# EAGLE design RFID_H2_v3 (EAGLE 9.6.1)
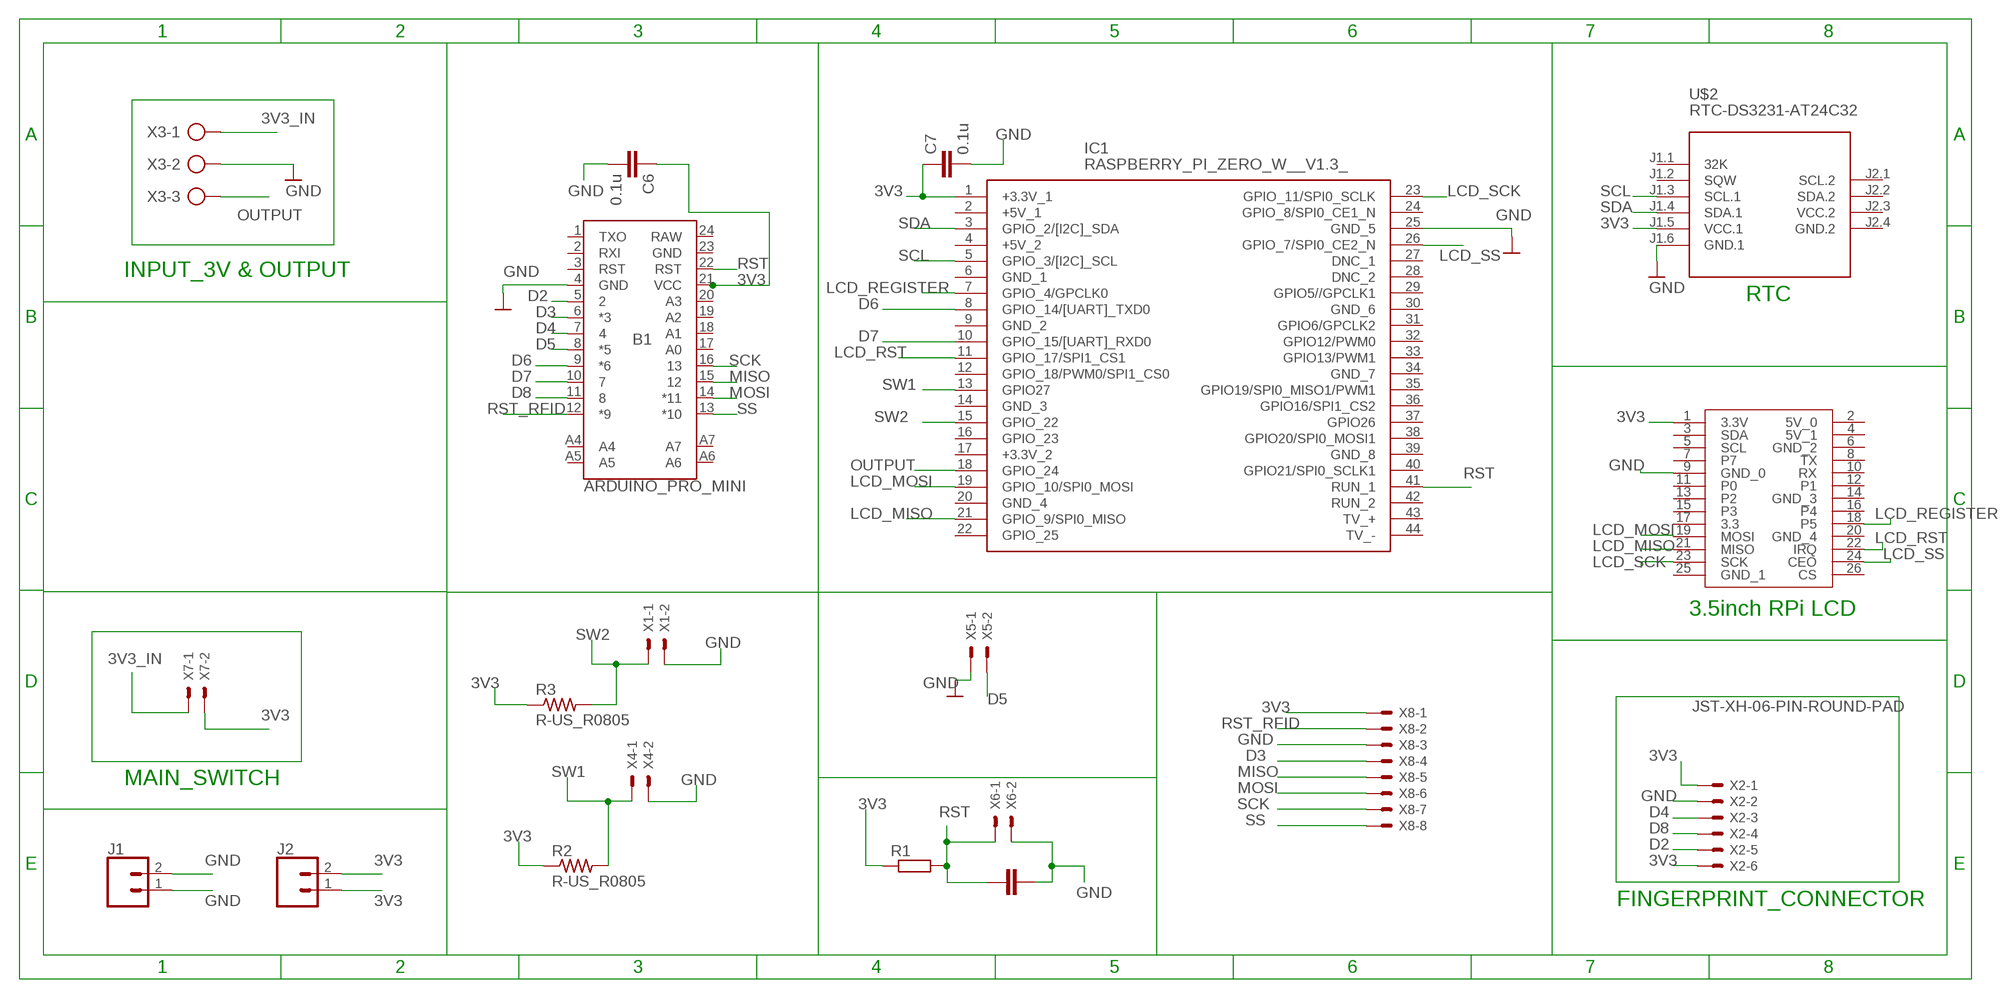
[diagram p0: schematic, sheet 1]

## Parts
B1  ARDUINO_PRO_MINI  [ARDUINO_PRO_MINI]
C5  10n  C-EUC0805K  [C0805K]
C6  0.1u  C-EUC0805  [C0805]
C7  0.1u  C-EUC0805  [C0805]
IC1  RASPBERRY_PI_ZERO_W__V1.3_  [RASPBERRYPIZEROWV13]
J1  CONN_02  [1X02]
J2  CONN_02  [1X02]
R1  R-EU_0204/5  [0204/5]
R2  R-US_R0805  [R0805]
R3  R-US_R0805  [R0805]
U$2  RTC-DS3231-AT24C32  [RTC-DS3231-AT24C32]
U$7  3.5_INCH_TOUCHSCREEN  [FE13-2]
X1  JST-XH-02-PIN-LONG-PAD  [JST-XH-02-PACKAGE-LONG-PAD]
X2  JST-XH-06-PIN-ROUND-PAD  [JST-XH-06-PACKAGE-ROUND-PAD]
X3  AK500/3-H  [AK500/3-H]
X4  JST-XH-02-PIN-LONG-PAD  [JST-XH-02-PACKAGE-LONG-PAD]
X5  JST-XH-02-PIN-LONG-PAD  [JST-XH-02-PACKAGE-LONG-PAD]
X6  JST-XH-02-PIN-LONG-PAD  [JST-XH-02-PACKAGE-LONG-PAD]
X7  JST-XH-02-PIN-LONG-PAD  [JST-XH-02-PACKAGE-LONG-PAD]
X8  JST-XH-08-PIN-ROUND-PAD  [JST-XH-08-PACKAGE-ROUND-PAD]

## Nets
3V3: B1.21(VCC) C6.1 C7.1 IC1.1(+3.3V_1) J2.1 J2.2 R1.1 R2.1 R3.1 U$2.J1.5(VCC.1) U$7.1(3.3V) X2.1 X2.6 X7.2 X8.1
3V3_IN: X3.1 X7.1
D2: B1.5 X2.5
D3: B1.6(*3) X8.4
D4: B1.7 X2.3
D5: B1.8(*5) X5.2
D6: B1.9(*6) IC1.8(GPIO_14/[UART]_TXD0)
D7: B1.10 IC1.10(GPIO_15/[UART]_RXD0)
D8: B1.11 X2.4
GND: B1.4(GND) C5.1 C6.2 C7.2 IC1.25(GND_5) J1.1 J1.2 U$2.J1.6(GND.1) U$7.9(GND_0) X1.2 X2.2 X3.2 X4.2 X5.1 X6.2 X8.3
LCD_MISO: IC1.21(GPIO_9/SPI0_MISO) U$7.21(MISO)
LCD_MOSI: IC1.19(GPIO_10/SPI0_MOSI) U$7.19(MOSI)
LCD_REGISTER: IC1.7(GPIO_4/GPCLK0) U$7.18(P5)
LCD_RST: IC1.11(GPIO_17/SPI1_CS1) U$7.22(IRQ)
LCD_SCK: IC1.23(GPIO_11/SPI0_SCLK) U$7.23(SCK)
LCD_SS: IC1.26(GPIO_7/SPI0_CE2_N) U$7.24(CEO)
MISO: B1.15 X8.5
MOSI: B1.14(*11) X8.6
OUTPUT: IC1.18(GPIO_24) X3.3
RST: B1.22(RST) C5.2 IC1.41(RUN_1) R1.2 X6.1
RST_RFID: B1.12(*9) X8.2
SCK: B1.16 X8.7
SCL: IC1.5(GPIO_3/[I2C]_SCL) U$2.J1.3(SCL.1)
SDA: IC1.3(GPIO_2/[I2C]_SDA) U$2.J1.4(SDA.1)
SS: B1.13(*10) X8.8
SW1: IC1.13(GPIO27) R2.2 X4.1
SW2: IC1.15(GPIO_22) R3.2 X1.1
Unconnected: B1.1(TXO) B1.2(RXI) B1.3(RST) B1.17(A0) B1.18(A1) B1.19(A2) B1.20(A3) B1.A4 B1.A5 B1.A6 B1.A7 IC1.2(+5V_1) IC1.4(+5V_2) IC1.6(GND_1) IC1.9(GND_2) IC1.12(GPIO_18/PWM0/SPI1_CS0) IC1.14(GND_3) IC1.16(GPIO_23) IC1.17(+3.3V_2) IC1.20(GND_4) IC1.22(GPIO_25) IC1.24(GPIO_8/SPI0_CE1_N) IC1.27(DNC_1) IC1.28(DNC_2) IC1.29(GPIO5//GPCLK1) IC1.30(GND_6) IC1.31(GPIO6/GPCLK2) IC1.32(GPIO12/PWM0) IC1.33(GPIO13/PWM1) IC1.34(GND_7) IC1.35(GPIO19/SPI0_MISO1/PWM1) IC1.36(GPIO16/SPI1_CS2) IC1.37(GPIO26) IC1.38(GPIO20/SPI0_MOSI1) IC1.39(GND_8) IC1.40(GPIO21/SPI0_SCLK1) IC1.42(RUN_2) IC1.43(TV_+) IC1.44(TV_-) U$2.J1.1(32K) U$2.J1.2(SQW) U$2.J2.1(SCL.2) U$2.J2.2(SDA.2) U$7.2(5V_0) U$7.3(SDA) U$7.4(5V_1) U$7.5(SCL) U$7.6(GND_2) U$7.7 U$7.8(TX) U$7.10(RX) U$7.11(P0) U$7.12(P1) U$7.13(P2) U$7.14(GND_3) U$7.15(P3) U$7.16(P4) U$7.17(3.3) U$7.20(GND_4) U$7.25(GND_1) U$7.26(CS)

## Notes on the sheet
- INPUT_3V & OUTPUT
- RTC
- 3.5inch RPi LCD
- MAIN_SWITCH
- FINGERPRINT_CONNECTOR

## Power pins joined to a net without a drawn wire
GND: B1.23(GND)
GND.2: U$2.J2.4(GND.2)
RAW: B1.24(RAW)
VCC.2: U$2.J2.3(VCC.2)

## Library data of the parts
B1 = SparkFun-Boards:ARDUINO_PRO_MINI: SparkFun Pro Mini Pro Mini compatible footprint. Dimensions: 0.7 x 1.3" PCB Thickness: 0.8mm SparkFun Products: 3.3V/8MHz <https://www.sparkfun.com/products/11114> 5V/16MHz <https://www.sparkfun.com/products/11113>
C5-C7 = rcl:C-EU: CAPACITOR, European symbol; SPICEPREFIX: C
IC1 = Raspberry_Pi_Zero_W__v1.3_:RASPBERRY_PI_ZERO_W__V1.3_: Raspberry Pi Zero W (v1.3) Single-board Computers Source: Datasheet <https://cdn.sparkfun.com/assets/learn_tutorials/6/7/6/PiZero_1.pdf>; DESCRIPTION: Raspberry Pi Zero W (v1.3) Single-board Computers; HEIGHT: mm; MANUFACTURER_NAME: RASPBERRY-PI; MANUFACTURER_PART_NUMBER: Raspberry Pi Zero W (v1.3)
J1 J2 = SparkFun-Connectors:CONN_02: Multi connection point. Often used as Generic Header-pin footprint for 0.1 inch spaced/style header connections On any of the 0.1 inch spaced packages, you can populate with these: Break Away Headers - Straight <https://www.sparkfun.com/products/116> (PRT-00116) Break Away Male Headers - Right Angle <https://www.sparkfun.com/products/553> (PRT-00553) Female Headers <https://www.sparkfun.com/products/115> (PRT-00115) Break Away Headers - Machine Pin <https://www.sparkfun.com/products/117> (PRT-00117) Break Away Female Headers - Swiss Machine Pin <https://www.sparkfun.com/products/743> (PRT-00743) For SCREWTERMINALS and SPRING TERMINALS visit here: Screw Terimnals on SparkFun.com <https://www.sparkfun.com/search/results?term=Screw+Terminals> (5mm/3.5mm/2.54mm spacing) This device is also useful as a general connection point to wire up your design to another part of your project. Our various solder wires solder well into these plated through hole pads. Hook-Up Wire - Assortment (Stranded, 22 AWG) <https://www.sparkfun.com/products/11375> (PRT-11375) Hook-Up Wire - Assortment (Solid Core, 22 AWG) <https://www.sparkfun.com/products/11367> (PRT-11367) View the entire wire category on our website here <https://www.sparkfun.com/categories/141> Special notes: Molex polarized connector foot print use with: PRT-08233 with associated crimp pins and housings. 2.54_SCREWTERM for use with PRT-10571. 3.5mm Screw Terminal footprints for PRT-08084 5mm Screw Terminal footprints for use with PRT-08432
R1 = resistor:R-EU_: RESISTOR, European symbol
R2 R3 = audio amplifier example:R-US_: RESISTOR, American symbol
U$2 = diy-modules:RTC-DS3231-AT24C32: RTC Module with Battery and EEPROM based on DS3231 and AT24C32 chips Tutorial can be found here: https://edwardmallon.wordpress.com/2014/05/21/using-a-cheap-3-ds3231-rtc-at24c32-eeprom-from-ebay/ Click here to find device on ebay.com <http://www.ebay.com/sch/DS3231+AT24C32+module>
U$7 = 3.5_inch_touchscreen:3.5_INCH_TOUCHSCREEN
X1 X4-X7 = Rembrandt Electronics - JST XH Connectors v1-0:JST-XH-02-PIN: JST XH Connector 2 Pin Wire to board connector. Pitch: 2,54 mm, (0.100") Number of pins: 2 Created by Rembrandt Electronics www.rembrandtelectronics.com
X2 = Rembrandt Electronics - JST XH Connectors v1-0:JST-XH-06-PIN: JST XH Connector 2 Pin Wire to board connector. Pitch: 2,54 mm, (0.100") Number of pins: 6 Created by Rembrandt Electronics www.rembrandtelectronics.com
X3 = con-ptr500:AK500/3-H: CONNECTOR Aug. 2004 / PTR Meßtechnik: Die Bezeichnung der Serie AK505 wurde geändert. Es handelt sich hierbei um AK500 in horizontaler Ausführung.; OC_FARNELL: unknown; OC_NEWARK: unknown
X8 = Rembrandt Electronics - JST XH Connectors v1-0:JST-XH-08-PIN: JST XH Connector 2 Pin Wire to board connector. Pitch: 2,54 mm, (0.100") Number of pins: 8 Created by Rembrandt Electronics www.rembrandtelectronics.com

## Board
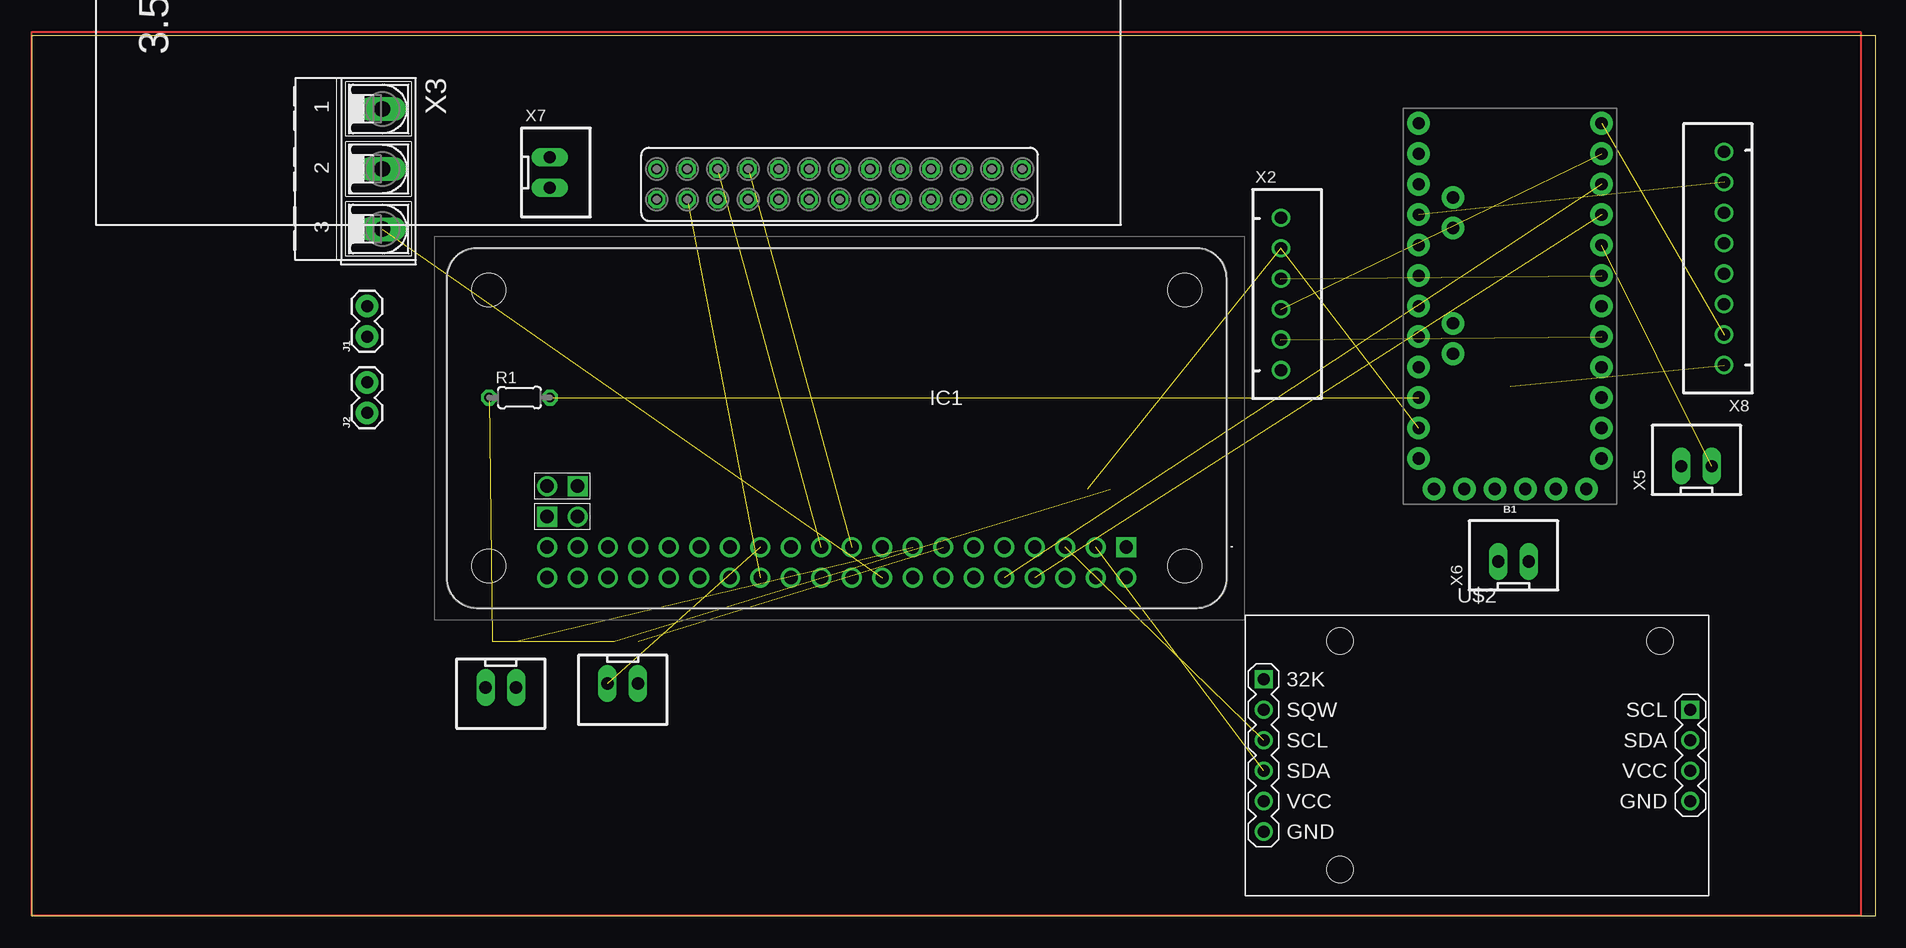
[diagram p1: board, top side]
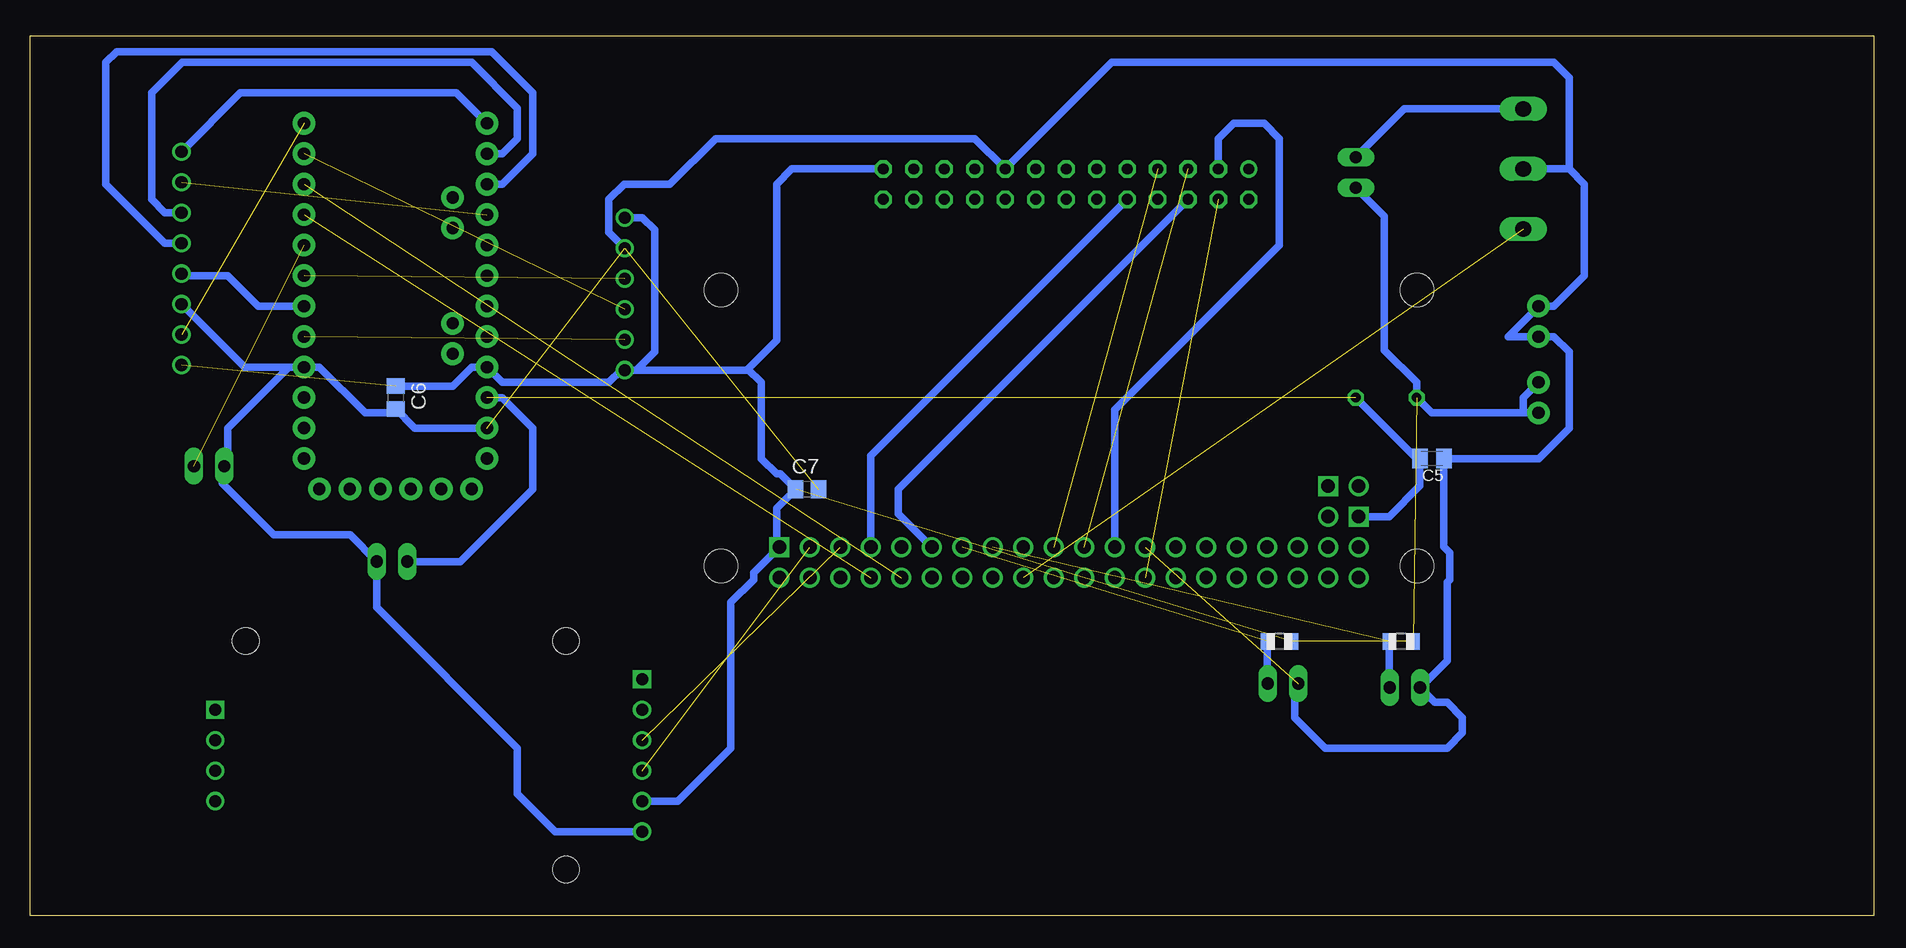
[diagram p2: board, bottom side, seen from below]

Size 153.65 x 73.33 mm. Coordinates in mm from the lower left corner, seen from the top.
Outline: 0,0 153.65,0 153.65,73.33 0,73.33 0,0
Copper layers (1*16): Top 0.035mm / dielectric 1.5mm / Bottom 0.035mm
Design rules "default": minimum track width 6mil, minimum drill 0.35mm, track to track 6mil, track to pad 6mil, pad to pad 6mil, via to via 6mil, smd to smd 6mil, copper to edge 40mil, drill to drill 6mil, minimum pad ring 10mil, minimum via ring 8mil, stop-mask expansion 4mil, vias tented up to drill 0mil, thermal gap 10mil

### Footprints (pad centres in the part's own frame; a part is rotated, then mirrored left to right if it is on the bottom)
ARDUINO_PRO_MINI = drill 1.016 pad 1.88: 1 -7.62,12.7; 2 -7.62,10.16; 3 -7.62,7.62; 4 -7.62,5.08; 5 -7.62,2.54; 6 -7.62,0; 7 -7.62,-2.54; 8 -7.62,-5.08; 9 -7.62,-7.62; 10 -7.62,-10.16; 11 -7.62,-12.7; 12 -7.62,-15.24; 13 7.62,-15.24; 14 7.62,-12.7; 15 7.62,-10.16; 16 7.62,-7.62; 17 7.62,-5.08; 18 7.62,-2.54; 19 7.62,0; 20 7.62,2.54; 21 7.62,5.08; 22 7.62,7.62; 23 7.62,10.16; 24 7.62,12.7; A4 4.763,1.429; A5 4.763,3.969; A6 4.763,-9.049; A7 4.763,-6.509; BLK -6.35,15.24; GND -3.81,15.24; GRN 6.35,15.24; RXI 1.27,15.24; TXO 3.81,15.24; VCC -1.27,15.24
C0805K = smd 1.3 x 1.6: 1 -1,0; 2 1,0
C0805 = smd 1.3 x 1.5: 1 -0.95,0; 2 0.95,0
RASPBERRYPIZEROWV13 = drill 1.11 pad 1.665 square: 1 -23.885,9.92; 41 24.375,7.38; 43 21.835,4.84 | drill 1.11 pad 1.665: 2 -23.885,12.46; 3 -21.345,9.92; 4 -21.345,12.46; 5 -18.805,9.92; 6 -18.805,12.46; 7 -16.265,9.92; 8 -16.265,12.46; 9 -13.725,9.92; 10 -13.725,12.46; 11 -11.185,9.92; 12 -11.185,12.46; 13 -8.645,9.92; 14 -8.645,12.46; 15 -6.105,9.92; 16 -6.105,12.46; 17 -3.565,9.92; 18 -3.565,12.46; 19 -1.025,9.92; 20 -1.025,12.46; 21 1.515,9.92; 22 1.515,12.46; 23 4.055,9.92; 24 4.055,12.46; 25 6.595,9.92; 26 6.595,12.46; 27 9.135,9.92; 28 9.135,12.46; 29 11.675,9.92; 30 11.675,12.46; 31 14.215,9.92; 32 14.215,12.46; 33 16.755,9.92; 34 16.755,12.46; 35 19.295,9.92; 36 19.295,12.46; 37 21.835,9.92; 38 21.835,12.46; 39 24.375,9.92; 40 24.375,12.46; 42 21.835,7.38; 44 24.375,4.84 | hole 2.8: -28.755,11.5; -28.755,-11.5; 29.245,-11.5; 29.245,11.5
1X02 = drill 1.016 pad 1.88: 1 0,0; 2 2.54,0
0204/5 = drill 0.813 octagon: 1 -2.54,0; 2 2.54,0
R0805 = smd 1.1 x 1.4: 1 -1,0; 2 1,0
RTC-DS3231-AT24C32 = drill 1 square: J1.1 -17.78,6.35; J2.1 17.78,3.81 | drill 1: J1.2 -17.78,3.81; J1.3 -17.78,1.27; J1.4 -17.78,-1.27; J1.5 -17.78,-3.81; J1.6 -17.78,-6.35; J2.2 17.78,1.27; J2.3 17.78,-1.27; J2.4 17.78,-3.81 | hole 2.2: -11.43,-9.525; -11.43,9.525; 15.24,9.525
FE13-2 = drill 0.914 octagon: 1 15.24,1.27; 2 15.24,-1.27; 3 12.7,1.27; 4 12.7,-1.27; 5 10.16,1.27; 6 10.16,-1.27; 7 7.62,1.27; 8 7.62,-1.27; 9 5.08,1.27; 10 5.08,-1.27; 11 2.54,1.27; 12 2.54,-1.27; 13 0,1.27; 14 0,-1.27; 15 -2.54,1.27; 16 -2.54,-1.27; 17 -5.08,1.27; 18 -5.08,-1.27; 19 -7.62,1.27; 20 -7.62,-1.27; 21 -10.16,1.27; 22 -10.16,-1.27; 23 -12.7,1.27; 24 -12.7,-1.27; 26 -15.24,-1.27 | drill 0.914: 25 -15.24,1.27
JST-XH-02-PACKAGE-LONG-PAD = drill 1.016 long: 1 -1.27,0; 2 1.27,0
JST-XH-06-PACKAGE-ROUND-PAD = drill 1.016: 1 -6.35,0; 2 -3.81,0; 3 -1.27,0; 4 1.27,0; 5 3.81,0; 6 6.35,0
AK500/3-H = drill 1.321 long: 1 -5.004,0; 2 0,0; 3 5.004,0
JST-XH-08-PACKAGE-ROUND-PAD = drill 1.016: 1 -8.89,0; 2 -6.35,0; 3 -3.81,0; 4 -1.27,0; 5 1.27,0; 6 3.81,0; 7 6.35,0; 8 8.89,0

### Placement (x,y rotation side)
B1  123.19,50.8 180 top
C5  36.83,38.1 180 bottom
C6  123.19,43.18 270 bottom
C7  88.9,35.56 0 bottom
IC1  67.31,40.64 180 top
J1  27.94,48.26 90 top
J2  27.94,41.91 90 top
R1  40.64,43.18 0 top
R2  49.53,22.86 180 bottom
R3  39.37,22.86 180 bottom
U$2  120.43,13.37 0 top
U$7  67.31,60.96 0 top
X1  39.08,19.02 180 top
X2  104.09,51.82 270 top
X3  29.21,62.23 270 top
X4  49.24,19.35 180 top
X5  138.72,37.47 0 top
X6  123.48,29.52 0 top
X7  43.16,61.94 270 top
X8  141.02,54.78 90 top

### Tracks (layer width: path | path; a pad name or v marks a point on that pad's centre or on a via)
3V3  (4 unrouted)
  Bottom 0.61: U$7.1 90.17,62.23 91.44,60.96 91.44,47.94 93.82,45.56 | 29.21,41.91 36.83,41.91 R1.1 38.1,44.45 40.79,47.14 40.79,58.3 X7.2 | 29.21,41.91 J2.1 | J2.2 29.21,43.18 29.21,41.91 | C6.1 118.43,44.13 116.84,45.72 B1.21 114.3,44.45 105.41,44.45 104.39,45.47 X2.6 | U$2.J1.5 99.66,9.56 95.25,13.97 95.25,26.11 93.34,28.01 93.34,28.57 IC1.1 91.44,30.96 91.44,33.97 C7.1 91.12,36.83 91.44,36.83 92.71,38.1 92.71,44.45 93.82,45.56 | X2.1 102.62,58.17 101.6,57.15 101.6,46.99 103.12,45.47 X2.6 | X2.6 93.91,45.47 93.82,45.56
3V3_IN
  Bottom 0.61: X3.1 39.14,67.23 X7.1
D2  (1 unrouted)
D3
  Bottom 0.61: X8.4 140.85,53.34 137.16,53.34 134.62,50.8 B1.6
D4  (1 unrouted)
D5  (1 unrouted)
D6  (1 unrouted)
D7  (1 unrouted)
D8  (1 unrouted)
GND  (3 unrouted)
  Bottom 0.61: X3.2 25.4,62.23 | 25.4,62.23 24.13,60.96 24.13,53.34 26.67,50.8 J1.2 30.48,48.26 J1.1 26.67,48.26 25.4,46.99 25.4,40.64 27.94,38.1 C5.1 35.83,30.75 35.34,30.27 35.34,28.01 35.56,27.8 35.56,21.27 X1.2 36.57,17.78 35.56,17.78 34.29,16.51 34.29,15.24 35.56,13.97 45.72,13.97 48.26,16.51 48.26,19.06 X4.2 | X8.3 135.77,45.72 132.08,45.72 | 132.08,45.72 B1.4 129.54,45.72 125.73,41.91 123.51,41.91 C6.2 121.6,40.64 B1.23 | 132.08,45.72 137.16,40.64 137.16,37.76 X5.1 137.62,37.3 137.62,36.02 133.35,31.75 126.98,31.75 X6.2 124.75,25.69 113.03,13.97 113.03,10.16 109.89,7.02 U$2.J1.6 | X2.2 105.41,56.95 105.41,59.69 104.14,60.96 100.33,60.96 96.52,64.77 74.93,64.77 U$7.9 63.5,71.12 26.67,71.12 25.4,69.85 25.4,62.23
LCD_MISO  (1 unrouted)
LCD_MOSI  (1 unrouted)
LCD_REGISTER
  Bottom 0.61: U$7.18 83.58,38.34 IC1.7
LCD_RST
  Bottom 0.61: U$7.22 81.28,35.56 81.28,33.51 IC1.11
LCD_SCK
  Bottom 0.61: IC1.23 63.26,42.16 49.53,55.88 49.53,64.77 50.8,66.04 53.34,66.04 54.61,64.77 U$7.23
LCD_SS  (1 unrouted)
MISO
  Bottom 0.61: X8.5 142.41,56.05 147.32,60.96 147.32,71.12 146.43,72.01 115.19,72.01 111.76,68.58 111.76,63.5 114.3,60.96 B1.15
MOSI
  Bottom 0.61: B1.14 114.3,63.5 113.03,64.77 113.03,67.31 116.84,71.12 140.97,71.12 143.51,68.58 143.51,59.69 142.41,58.59 X8.6
N$1
  Top 0.152: 0,0 0,73.66 152.4,73.66 152.4,0
N$2
  Top 0.152: 152.4,0 0,0
OUTPUT  (1 unrouted)
RST  (1 unrouted)
  Bottom 0.61: R1.2 38.1,38.1 C5.2 37.83,35.83 40.4,33.26 IC1.41 | X6.1 117.8,29.52 111.76,35.56 111.76,40.64 114.3,43.18 B1.22
RST_RFID  (1 unrouted)
SCK  (1 unrouted)
SCL  (1 unrouted)
SDA  (1 unrouted)
SS
  Bottom 0.61: B1.13 118.11,68.58 136.11,68.58 X8.8
SW1  (1 unrouted)
  Bottom 0.61: X4.1 50.53,19.37 R2.2
SW2  (1 unrouted)
  Bottom 0.61: R3.2 40.37,19.04 X1.1